# Altium project Placa_Alimentación.PrjPCB
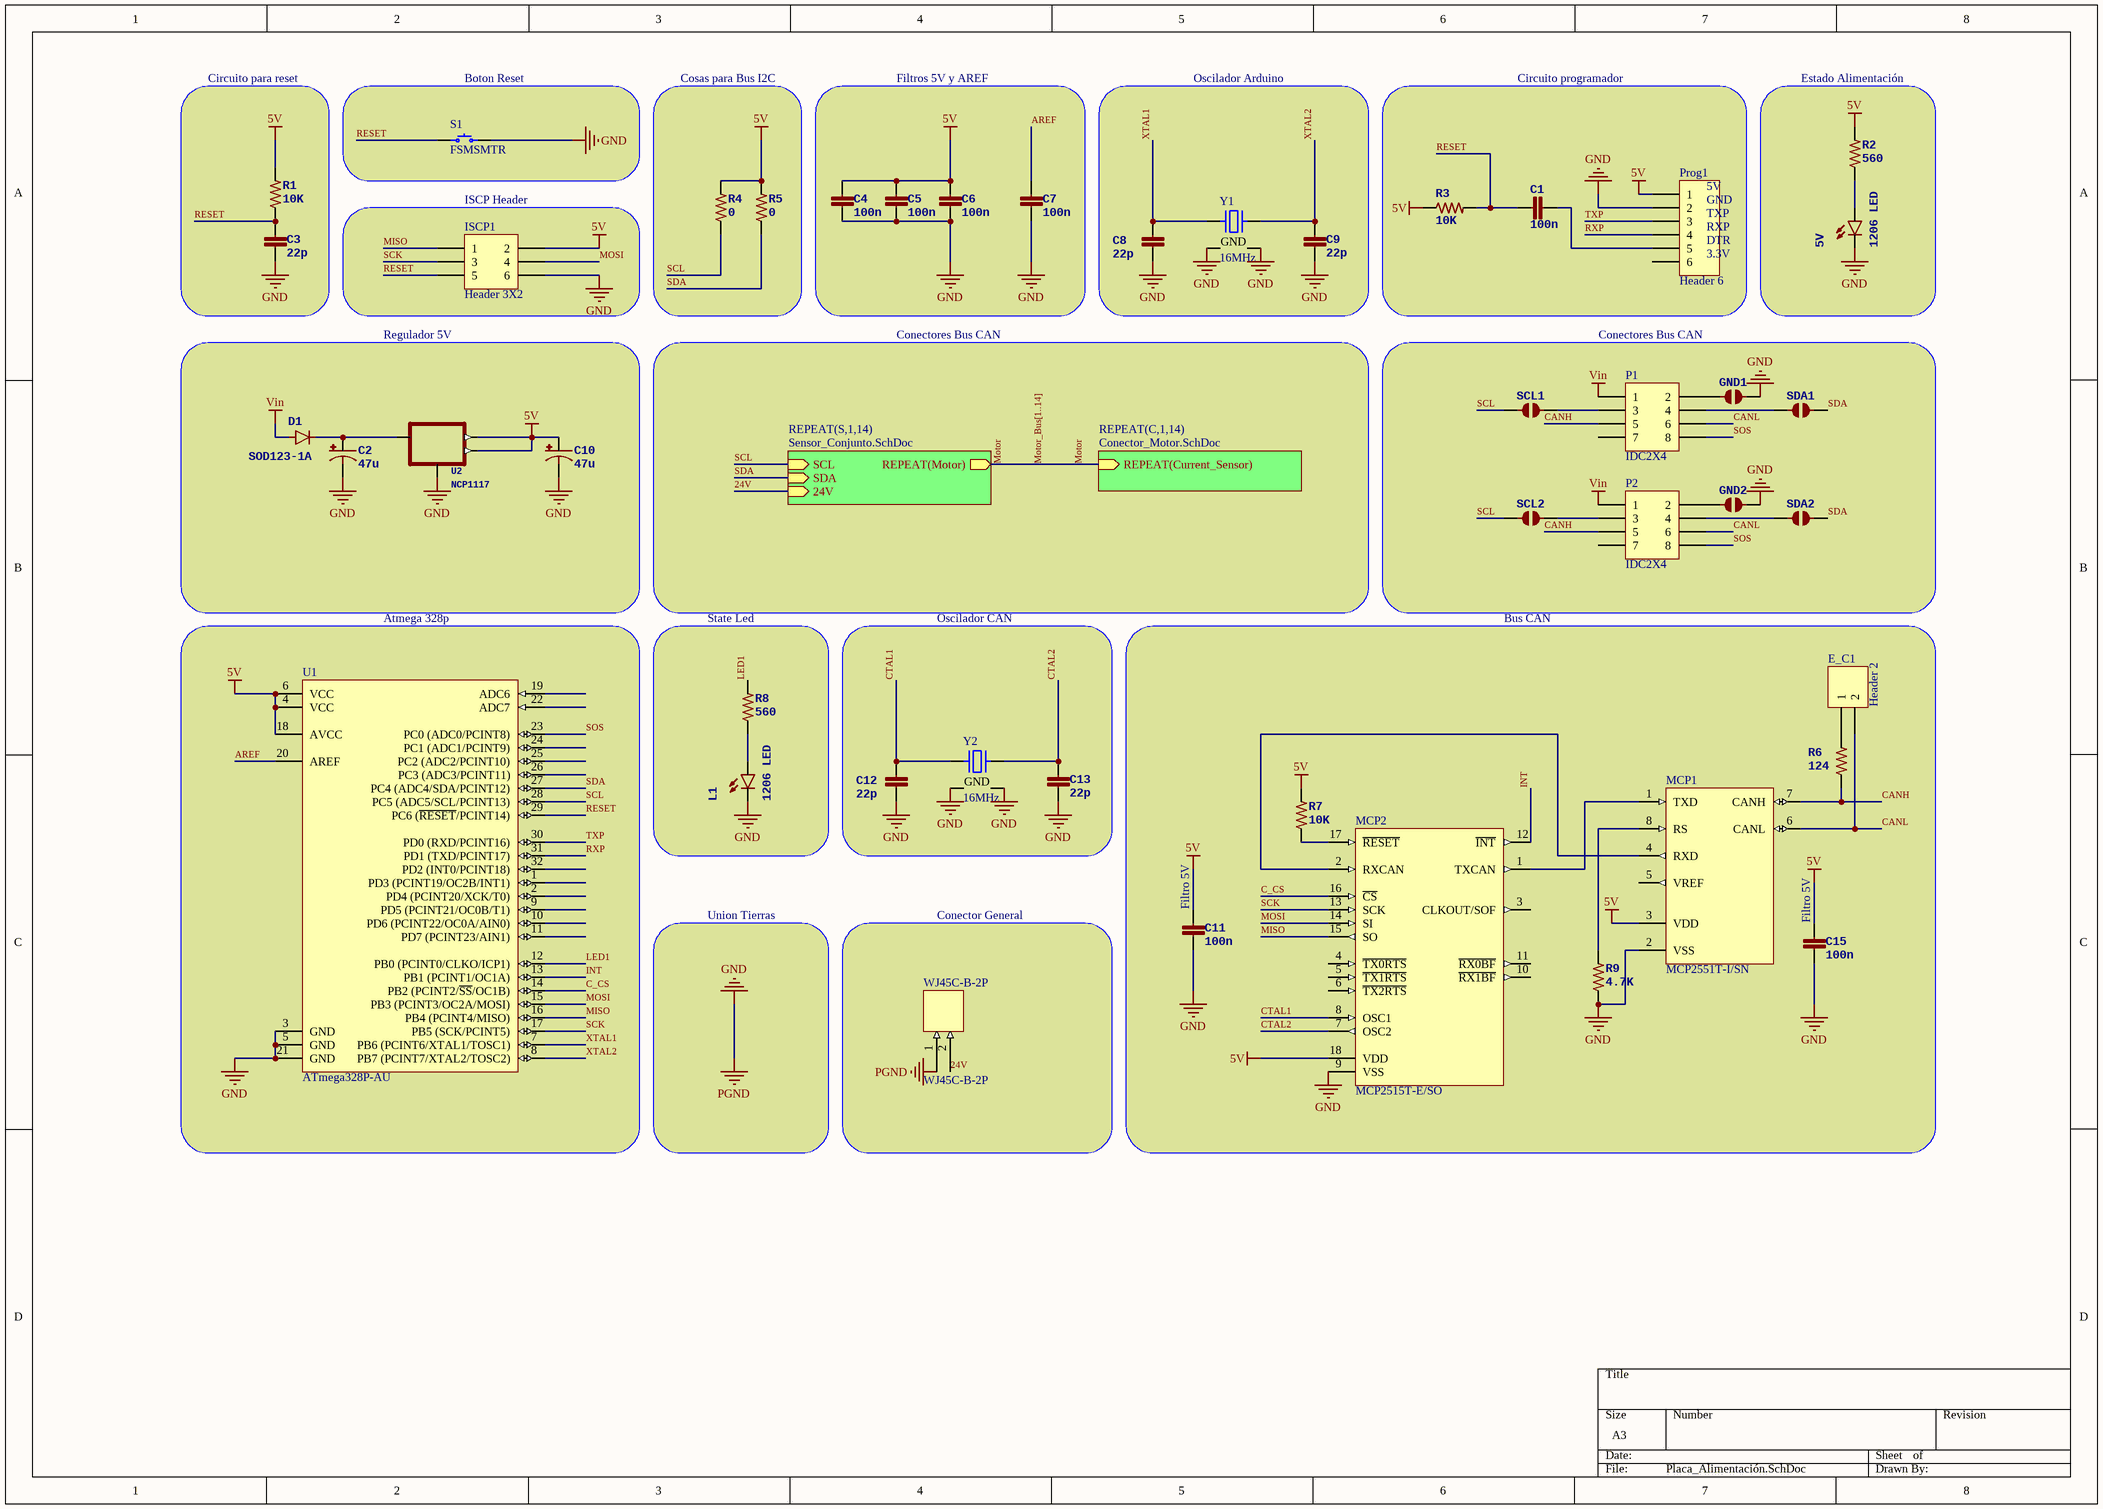
[diagram p0: Placa_Alimentación.SchDoc]
3 sheets, 157 parts. Net scope: hierarchical (ports join the sheet entries above them; power ports are global).
Board file: Placa_Alimentacion_v3.PcbDoc
Sheets:
  Placa_Alimentación.SchDoc
    C1 = Conector_Motor.SchDoc
    C2 = Conector_Motor.SchDoc
    C3 = Conector_Motor.SchDoc
    C4 = Conector_Motor.SchDoc
    C5 = Conector_Motor.SchDoc
    C6 = Conector_Motor.SchDoc
    C7 = Conector_Motor.SchDoc
    C8 = Conector_Motor.SchDoc
    C9 = Conector_Motor.SchDoc
    C10 = Conector_Motor.SchDoc
    C11 = Conector_Motor.SchDoc
    C12 = Conector_Motor.SchDoc
    C13 = Conector_Motor.SchDoc
    C14 = Conector_Motor.SchDoc
    S1 = Sensor_Conjunto.SchDoc
    S2 = Sensor_Conjunto.SchDoc
    S3 = Sensor_Conjunto.SchDoc
    S4 = Sensor_Conjunto.SchDoc
    S5 = Sensor_Conjunto.SchDoc
    S6 = Sensor_Conjunto.SchDoc
    S7 = Sensor_Conjunto.SchDoc
    S8 = Sensor_Conjunto.SchDoc
    S9 = Sensor_Conjunto.SchDoc
    S10 = Sensor_Conjunto.SchDoc
    S11 = Sensor_Conjunto.SchDoc
    S12 = Sensor_Conjunto.SchDoc
    S13 = Sensor_Conjunto.SchDoc
    S14 = Sensor_Conjunto.SchDoc

## Sheet Placa_Alimentación.SchDoc
size A3

### Parts
5V  1206 LED  [LED-1206]
C1  100n  [0805]
C2  47u  [PANASONIC_D]
C3  22p  [0805]
C4  100n  [0805]
C5  100n  [0805]
C6  100n  [0805]
C7  100n  [0805]
C8  22p  [0805]
C9  22p  [0805]
C10  47u  [PANASONIC_D]
C11  100n  [0805]
C12  22p  [0805]
C13  22p  [0805]
C15  100n  [0805]
D1  SOD123-1A  [SOD-123]
E_C1  Header 2  [HDR1X2]
GND1  JUMPER-PAD-2-NOYES_SILK  [PAD-JUMPER-2-NO_YES_SILK]  (value not drawn)
GND2  JUMPER-PAD-2-NOYES_SILK  [PAD-JUMPER-2-NO_YES_SILK]  (value not drawn)
ISCP1  Header 3X2  [HDR2X3]
L1  1206 LED  [LED-1206]
MCP1  MCP2551T-I/SN  [SOIC-SN8_N]
MCP2  MCP2515T-E/SO  [SOIC-SO18_N]
P1  IDC2X4  [IDC2X4]
P2  IDC2X4  [IDC2X4]
Prog1  Header 6  [HDR1X6]
R1  10K  [0805]
R2  560  [0805]
R3  10K  [0805]
R4  0  [0805]
R5  0  [0805]
R6  124  [0805]
R7  10K  [0805]
R8  560  [0805]
R9  4.7K  [0805]
S1  FSMSMTR  [TE FSMSMTR]
SCL1  JUMPER-PAD-2-NOYES_SILK  [PAD-JUMPER-2-NO_YES_SILK]  (value not drawn)
SCL2  JUMPER-PAD-2-NOYES_SILK  [PAD-JUMPER-2-NO_YES_SILK]  (value not drawn)
SDA1  JUMPER-PAD-2-NOYES_SILK  [PAD-JUMPER-2-NO_YES_SILK]  (value not drawn)
SDA2  JUMPER-PAD-2-NOYES_SILK  [PAD-JUMPER-2-NO_YES_SILK]  (value not drawn)
U1  ATmega328P-AU  [32A_N]
U2  NCP1117  [SOT223]
WJ45C-B-2P  WJ45C-B-2P  [WJ45C-B-2P]
Y1  16MHz  [NDK NX3225SA]
Y2  16MHz  [NDK NX3225SA]

### Blocks framed on the sheet
Circuito para reset: C3 R1
Boton Reset: S1
Cosas para Bus I2C: R4 R5
Filtros 5V y AREF: C4-C7
Oscilador Arduino: C8 C9 Y1
Estado Alimentación: 5V R2
ISCP Header: ISCP1
Regulador 5V: C2 C10 D1 U2
Conectores Bus CAN: GND1 GND2 P1 P2 SCL1 SCL2 SDA1 SDA2
Atmega 328p: U1
State Led: L1 R8
Oscilador CAN: C12 C13 Y2
Conector General: WJ45C-B-2P

### Sub-sheets
REPEAT(C,1,14) = Conector_Motor.SchDoc: REPEAT(Current_Sensor) (in)
REPEAT(S,1,14) = Sensor_Conjunto.SchDoc: REPEAT(Motor) (out), SCL (in), SDA (in), 24V (in)

### Nets
5V: C4.1 C5.1 C6.1 C10.+ C11.1 C15.1 ISCP1.2 MCP1.3(VDD) MCP2.18(VDD) Prog1.1 R1.2 R2.2 R3.1 R4.2 R5.2 R7.2 U1.4(VCC) U1.6(VCC) U1.18(AVCC) U2.2(OUT) U2.4(OUT@1)
GND: 5V.C C2.- C3.2 C4.2 C5.2 C6.2 C7.2 C8.2 C9.2 C10.- C11.2 C12.2 C13.2 C15.2 GND1.2 GND2.2 ISCP1.6 L1.C MCP1.2(VSS) MCP2.9(VSS) Prog1.2 R9.1 S1.2 U1.3(GND) U1.5(GND) U1.21(GND) U2.1(ADJ) WJ45C-B-2P.1 Y1.2(GND) Y1.4(GND) Y2.2(GND) Y2.4(GND)  [also labelled PGND]
Vin: D1.A P1.1 P2.1
24V: WJ45C-B-2P.2 ; sheet REPEAT(S,1,14)/24V
AREF: C7.1 U1.20(AREF)
C_CS: MCP2.16(~{CS}) U1.14(PB2_(PCINT2/~{SS}/OC1B))
CANH: MCP1.7(CANH) P1.5 P2.5 R6.1
CANL: E_C1.2 MCP1.6(CANL) P1.6 P2.6
CTAL1: C12.1 MCP2.8(OSC1) Y2.1
CTAL2: C13.1 MCP2.7(OSC2) Y2.3
INT: MCP2.12(~{INT}) U1.13(PB1_(PCINT1/OC1A))
LED1: R8.2 U1.12(PB0_(PCINT0/CLKO/ICP1))
MISO: ISCP1.1 MCP2.15(SO) U1.16(PB4_(PCINT4/MISO))
MOSI: ISCP1.4 MCP2.14(SI) U1.15(PB3_(PCINT3/OC2A/MOSI))
Motor: sheet REPEAT(C,1,14)/REPEAT(Current_Sensor), sheet REPEAT(S,1,14)/REPEAT(Motor)
RESET: C1.1 C3.1 ISCP1.5 R1.1 R3.2 S1.1 U1.29(PC6_(~{RESET}/PCINT14))
RXP: Prog1.4 U1.31(PD1_(TXD/PCINT17))
SCK: ISCP1.3 MCP2.13(SCK) U1.17(PB5_(SCK/PCINT5))
SCL: R4.1 SCL1.1 SCL2.1 U1.28(PC5_(ADC5/SCL/PCINT13)) ; sheet REPEAT(S,1,14)/SCL
SDA: R5.1 SDA1.2 SDA2.2 U1.27(PC4_(ADC4/SDA/PCINT12)) ; sheet REPEAT(S,1,14)/SDA
SOS: P1.8 P2.8 U1.23(PC0_(ADC0/PCINT8))
TXP: Prog1.3 U1.30(PD0_(RXD/PCINT16))
XTAL1: C8.1 U1.7(PB6_(PCINT6/XTAL1/TOSC1)) Y1.1
XTAL2: C9.1 U1.8(PB7_(PCINT7/XTAL2/TOSC2)) Y1.3
Net5V_A: 5V.A R2.1
NetC1_2: C1.2 Prog1.5
NetC2_+: C2.+ D1.C U2.3(IN)
NetE_C1_1: E_C1.1 R6.2
NetGND1_1: GND1.1 P1.2
NetGND2_1: GND2.1 P2.2
NetL1_A: L1.A R8.1
NetMCP1_1: MCP1.1(TXD) MCP2.1(TXCAN)
NetMCP1_4: MCP1.4(RXD) MCP2.2(RXCAN)
NetMCP1_8: MCP1.8(RS) R9.2
NetMCP2_17: MCP2.17(~{RESET}) R7.1
NetP1_3: P1.3 SCL1.2
NetP1_4: P1.4 SDA1.1
NetP2_3: P2.3 SCL2.2
NetP2_4: P2.4 SDA2.1

Not connected (* = marked no-connect by the designer): MCP1 5(VREF); MCP2 3(CLKOUT/SOF) 4(~{TX0RTS}) 5(~{TX1RTS}) 6(~{TX2RTS}) 10(~{RX1BF}) 11(~{RX0BF}); P1 7; P2 7; Prog1 6; U1 1(PD3_(PCINT19/OC2B/INT1)) 2(PD4_(PCINT20/XCK/T0)) 9(PD5_(PCINT21/OC0B/T1)) 10(PD6_(PCINT22/OC0A/AIN0)) 11(PD7_(PCINT23/AIN1)) 19(ADC6) 22(ADC7) 24(PC1_(ADC1/PCINT9)) 25(PC2_(ADC2/PCINT10)) 26(PC3_(ADC3/PCINT11)) 32(PD2_(INT0/PCINT18))

### Buses and harness runs
bus Motor_Bus[1..14]

### Notes on the sheet
- Circuito programador
- (near Prog1) 5V
- (near Prog1) GND
- (near Prog1) TXP
- (near Prog1) RXP
- (near Prog1) DTR
- (near Prog1) 3.3V
- Conectores Bus CAN
- Bus CAN
- Union Tierras
- (near C11) Filtro 5V
- (near C15) Filtro 5V

### Library data of the parts
5V L1 = LED1206
C1 C3-C9 C11-C13 C15 = CAP0805
C2 C10 = 47UF-50V-20%(ELECT): PROD_ID: CAP-10547
D1 = DIODESOD123
E_C1 = Header 2: Header, 2-Pin; LatestRevisionDate: 17-Jul-2002; LatestRevisionNote: Re-released for DXP Platform.; Publisher: Altium Limited
ISCP1 = Header 3X2: Header, 3-Pin, Dual row; LatestRevisionDate: 17-Jul-2002; LatestRevisionNote: Re-released for DXP Platform.; Publisher: Altium Limited
MCP1 = MCP2551T-I/SN: High-Speed CAN Transceiver, 8-Pin SOIC, Industrial Temperature, Tape and Reel; Published: 29-Jan-2009; DatasheetVersion: revE, Jan-2007; PackageVersion: revBB, Aug-2009; PackageReference: SOIC-SN8; Publisher: Altium Limited; PackageDescription: 8-Lead Plastic Small Outline (SN) - Narrow, 3.90mm Body [SOIC]; Supplier 1: Digi-Key; Supplier Part Number 1: MCP2551T-I/SNTR-ND; Supplier 2: Farnell; Supplier Part Number 2: 1788569; Code_JEDEC: MS-012; Code_IPC: SOIC127P600-8; ComponentLink1Description: Datasheet; ComponentLink1URL: http://ww1.microchip.com/downloads/en/DeviceDoc/21667E.pdf; ComponentLink2Description: Packaging Specification; ComponentLink2URL: http://www.microchip.com/stellent/groups/techpub_sg/documents/packagingspec/en012702.pdf; ComponentLink3Description: Microchip.com Home; ComponentLink3URL: http://www.microchip.com/
MCP2 = MCP2515T-E/SO: Stand-Alone CAN Controller With SPI Interface, 18-Pin SOIC, Extended Temperature, Tape and Reel; Published: 29-Jan-2009; DatasheetVersion: revE, Nov-2007; PackageVersion: revBB, Aug-2009; PackageReference: SOIC-SO18; Publisher: Altium Limited; PackageDescription: 18-Lead Plastic Small Outline (SO) - Wide 7.50mm Body [SOIC]; Supplier 1: Digi-Key; Supplier Part Number 1: MCP2515T-E/SO-ND; Code_JEDEC: MS-013; ComponentLink1Description: Datasheet; ComponentLink1URL: http://ww1.microchip.com/downloads/en/DeviceDoc/21801e.pdf; ComponentLink2Description: Packaging Specification; ComponentLink2URL: http://www.microchip.com/stellent/groups/techpub_sg/documents/packagingspec/en012702.pdf; ComponentLink3Description: Microchip.com Home; ComponentLink3URL: http://www.microchip.com/
P1 P2 = IDC2X4: Header, 4-Pin, Dual row; LatestRevisionDate: 17-Jul-2002; LatestRevisionNote: Re-released for DXP Platform.; Publisher: Altium Limited
Prog1 = Header 6: Header, 6-Pin; LatestRevisionDate: 17-Jul-2002; LatestRevisionNote: Re-released for DXP Platform.; Publisher: Altium Limited
R1-R9 = RESISTOR0805-RES
S1 = FSMSMTR: SWITCH TACTILE SPST-NO 0.05A 24V; Manufacturer: TE Connectivity Alcoswitch Switches; Switch Function: Off-Mom; Contact Rating @ Voltage: 0.05A @ 24VDC; Actuator Type: Standard; Actuator Orientation: Top Actuated; Illumination: Non-Illuminated; Operating Force: 180gf; Switch Travel: 0.25mm; Mechanical Life: 20,000 Cycles; Part Number: FSMSMTR; PartId: 8251; Supplier 1: Digi-Key; Supplier Part Number 1: 450-1758-2-ND; ComponentLink1Description: Datasheet; ComponentLink1URL: http://www.te.com/commerce/DocumentDelivery/DDEController?Action=srchrtrv&DocNm=1437566-3&DocType=Customer+Drawing&DocLang=English; ComponentLink2Description: Digi-Key Listing; ComponentLink2URL: http://www.digikey.com/product-detail/en/FSMSMTR/450-1758-2-ND/529671; Price: 0,175; Circuit: SPST-NO; Illumination Voltage: -; Illumination Type, Colour: -; Operating Temperature: -35C ~ 85C
U1 = ATmega328P-AU: 8-bit AVR Microcontroller, 32KB Flash, 1KB EEPROM, 2KB SRAM, 32-pin TQFP, Industrial Grade (-40°C to 85°C); Published: 1-Apr-2010; DatasheetVersion: revA, Jan-2010; PackageVersion: revB, Oct-2001; PackageReference: 32A; Publisher: Altium Limited; PackageDescription: 32-Lead, 7x7x1.0 mm Body, 0.8mm Lead Pitch, Thin Profile Plastic Quad Flat Package (TQFP); Supplier 1: Digi-Key; Supplier Part Number 1: ATMEGA328P-AU-ND; Supplier 2: Farnell; Supplier Part Number 2: 1715486; Supplier 3: Mouser; Supplier Part Number 3: 556-ATMEGA328P-AU; Code_JEDEC: MS-026-ABA; ComponentLink1Description: Manufacturer Link; ComponentLink1URL: http://www.atmel.com/products/avr/default.asp?; ComponentLink2Description: ATmega48A/48PA/88A/88PA/168A/168PA/328/328P Datasheet; ComponentLink2URL: http://www.atmel.com/dyn/resources/prod_documents/8271.pdf; ComponentLink3Description: ATmega48A/48PA/88A/88PA/168A/168PA/328/328P Summary; ComponentLink3URL: http://www.atmel.com/dyn/resources/prod_documents/8271S.pdf; ComponentLink4Description: Atmel.com Home; ComponentLink4URL: http://www.atmel.com
U2 = V_REG_LM1117SOT223: PROD_ID: VREG-08170
Y1 Y2 = NX3225SA-16.000MHZ-STD-CSR-1: CRYSTAL 16.0000MHZ 8PF SMD; Manufacturer: NDK; Frequency Stability: 15ppm; ESR: 80 Ohm; Operating Mode: Fundamental; Part Number: NX3225SA-16.000MHZ-STD-CSR-1; PartId: 8509; Supplier 1: Digi-Key; Supplier Part Number 1: 644-1049-2-ND; ComponentLink1Description: Datasheet; ComponentLink1URL: http://media.digikey.com/pdf/Data%20Sheets/NDK%20PDFs/NX3225SA.pdf; ComponentLink2Description: Digi-Key Listing; ComponentLink2URL: http://www.digikey.com/product-detail/en/NX3225SA-16.000MHZ-STD-CSR-1/644-1049-2-ND/1128831; Price: 0,3799; Type: MHz Crystal; Device Package: 4-SMD, No Lead (DFN, LCC); Frequency: 16MHz; Frequency Tolerance: 15ppm; Load Capacitance: 8pF

## Sheet Conector_Motor.SchDoc
size A4
Used 14 times, as channels C1, C2, C3, C4, C5, C6, C7, C8, C9, C10, C11, C12, C13, C14. Parts and nets are listed once, with the designators drawn on the sheet.
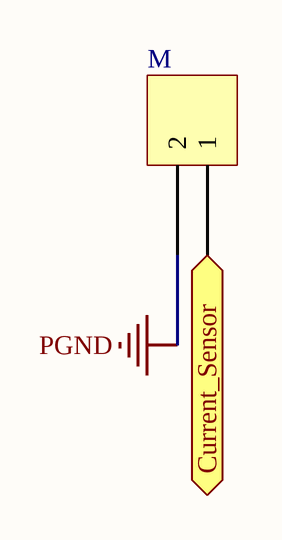
[diagram p1: Conector_Motor.SchDoc]

### Parts
M  20020110-D021A01LF  [FCI 06-381-2PIN]  (value not drawn)

### Ports
Current_Sensor (in)

### Nets
PGND: M.2
Current_Sensor: M.1 ; port Current_Sensor

### Channels
C1: designators end in _C1; ports Current_Sensor=M
C2: designators end in _C2; ports Current_Sensor=M
C3: designators end in _C3; ports Current_Sensor=M
C4: designators end in _C4; ports Current_Sensor=M
C5: designators end in _C5; ports Current_Sensor=M
C6: designators end in _C6; ports Current_Sensor=M
C7: designators end in _C7; ports Current_Sensor=M
C8: designators end in _C8; ports Current_Sensor=M
C9: designators end in _C9; ports Current_Sensor=M
C10: designators end in _C10; ports Current_Sensor=M
C11: designators end in _C11; ports Current_Sensor=M
C12: designators end in _C12; ports Current_Sensor=M
C13: designators end in _C13; ports Current_Sensor=M
C14: designators end in _C14; ports Current_Sensor=M

### Library data of the parts
M = 20020110-D021A01LF: TERM BLOCK HDR 2POS R/A 3.81MM; Manufacturer: FCI; TemperatureRange: -40C ~ 115C; Voltage: 300V; Pitch: 0.150" (3.81mm); Number Of Positions: 2; Number Of Levels: 1; Part Number: 20020110-D021A01LF; PartId: 7785; Supplier 1: Digi-Key; Supplier Part Number 1: 609-3819-ND; ComponentLink1Description: Datasheet; ComponentLink1URL: http://portal.fciconnect.com/Comergent//fci/drawing/20020110.pdf; ComponentLink2Description: Digi-Key Listing; ComponentLink2URL: http://www.digikey.ca/product-detail/en/20020110-D021A01LF/609-3819-ND/2261255; Price: 0,75; Type: Through Hole; Colour: Green; Orientation: 90, Right Angle; Positions Per Level: 2

## Sheet Sensor_Conjunto.SchDoc
size A4
Used 14 times, as channels S1, S2, S3, S4, S5, S6, S7, S8, S9, S10, S11, S12, S13, S14. Parts and nets are listed once, with the designators drawn on the sheet.
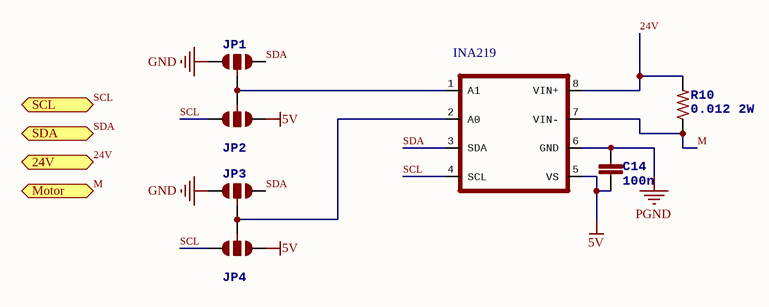
[diagram p2: Sensor_Conjunto.SchDoc]

### Parts
C14  100n  [0805]
IC1  INA219  [SO08]
JP1  JUMPER-PAD-3-NOYES_SILK  [PAD-JUMPER-3-NO_YES_SILK]  (value not drawn)
JP2  JUMPER-PAD-3-NOYES_SILK  [PAD-JUMPER-3-NO_YES_SILK]  (value not drawn)
JP3  JUMPER-PAD-3-NOYES_SILK  [PAD-JUMPER-3-NO_YES_SILK]  (value not drawn)
JP4  JUMPER-PAD-3-NOYES_SILK  [PAD-JUMPER-3-NO_YES_SILK]  (value not drawn)
R10  0.012 2W  [R2512]

### Ports
24V (in), Motor (out), SCL (in), SDA (in)

### Nets
5V: C14.1 IC1.5(VS) JP2.1 JP4.1
GND: JP1.1 JP3.1
PGND: C14.2 IC1.6(GND)
24V: IC1.8(VIN+) R10.2 ; port 24V
M: IC1.7(VIN-) R10.1 ; port Motor
SCL: IC1.4(SCL) JP2.3 JP4.3 ; port SCL
SDA: IC1.3(SDA) JP1.3 JP3.3 ; port SDA
NetIC1_1: IC1.1(A1) JP1.2 JP2.2
NetIC1_2: IC1.2(A0) JP3.2 JP4.2

### Channels
S1: designators end in _S1; ports 24V=24V Motor=M SCL=SCL SDA=SDA
S2: designators end in _S2; ports 24V=24V Motor=M SCL=SCL SDA=SDA
S3: designators end in _S3; ports 24V=24V Motor=M SCL=SCL SDA=SDA
S4: designators end in _S4; ports 24V=24V Motor=M SCL=SCL SDA=SDA
S5: designators end in _S5; ports 24V=24V Motor=M SCL=SCL SDA=SDA
S6: designators end in _S6; ports 24V=24V Motor=M SCL=SCL SDA=SDA
S7: designators end in _S7; ports 24V=24V Motor=M SCL=SCL SDA=SDA
S8: designators end in _S8; ports 24V=24V Motor=M SCL=SCL SDA=SDA
S9: designators end in _S9; ports 24V=24V Motor=M SCL=SCL SDA=SDA
S10: designators end in _S10; ports 24V=24V Motor=M SCL=SCL SDA=SDA
S11: designators end in _S11; ports 24V=24V Motor=M SCL=SCL SDA=SDA
S12: designators end in _S12; ports 24V=24V Motor=M SCL=SCL SDA=SDA
S13: designators end in _S13; ports 24V=24V Motor=M SCL=SCL SDA=SDA
S14: designators end in _S14; ports 24V=24V Motor=M SCL=SCL SDA=SDA

### Library data of the parts
C14 = CAP0805
IC1 = INA219-SO8D
R10 = RESISTOR2512

## Nets that join several sheets
5V: Placa_Alimentación (21 pins), S1 (C14_S1.1 IC1_S1.5 JP2_S1.1 JP4_S1.1), S2 (C14_S2.1 IC1_S2.5 JP2_S2.1 JP4_S2.1), S3 (C14_S3.1 IC1_S3.5 JP2_S3.1 JP4_S3.1), S4 (C14_S4.1 IC1_S4.5 JP2_S4.1 JP4_S4.1), S5 (C14_S5.1 IC1_S5.5 JP2_S5.1 JP4_S5.1), S6 (C14_S6.1 IC1_S6.5 JP2_S6.1 JP4_S6.1), S7 (C14_S7.1 IC1_S7.5 JP2_S7.1 JP4_S7.1), S8 (C14_S8.1 IC1_S8.5 JP2_S8.1 JP4_S8.1), S9 (C14_S9.1 IC1_S9.5 JP2_S9.1 JP4_S9.1), S10 (C14_S10.1 IC1_S10.5 JP2_S10.1 JP4_S10.1), S11 (C14_S11.1 IC1_S11.5 JP2_S11.1 JP4_S11.1), S12 (C14_S12.1 IC1_S12.5 JP2_S12.1 JP4_S12.1), S13 (C14_S13.1 IC1_S13.5 JP2_S13.1 JP4_S13.1), S14 (C14_S14.1 IC1_S14.5 JP2_S14.1 JP4_S14.1)
GND: Placa_Alimentación (32 pins), C1 (M_C1.2), C2 (M_C2.2), C3 (M_C3.2), C4 (M_C4.2), C5 (M_C5.2), C6 (M_C6.2), C7 (M_C7.2), C8 (M_C8.2), C9 (M_C9.2), C10 (M_C10.2), C11 (M_C11.2), C12 (M_C12.2), C13 (M_C13.2), C14 (M_C14.2), S1 (C14_S1.2 IC1_S1.6 JP1_S1.1 JP3_S1.1), S2 (C14_S2.2 IC1_S2.6 JP1_S2.1 JP3_S2.1), S3 (C14_S3.2 IC1_S3.6 JP1_S3.1 JP3_S3.1), S4 (C14_S4.2 IC1_S4.6 JP1_S4.1 JP3_S4.1), S5 (C14_S5.2 IC1_S5.6 JP1_S5.1 JP3_S5.1), S6 (C14_S6.2 IC1_S6.6 JP1_S6.1 JP3_S6.1), S7 (C14_S7.2 IC1_S7.6 JP1_S7.1 JP3_S7.1), S8 (C14_S8.2 IC1_S8.6 JP1_S8.1 JP3_S8.1), S9 (C14_S9.2 IC1_S9.6 JP1_S9.1 JP3_S9.1), S10 (C14_S10.2 IC1_S10.6 JP1_S10.1 JP3_S10.1), S11 (C14_S11.2 IC1_S11.6 JP1_S11.1 JP3_S11.1), S12 (C14_S12.2 IC1_S12.6 JP1_S12.1 JP3_S12.1), S13 (C14_S13.2 IC1_S13.6 JP1_S13.1 JP3_S13.1), S14 (C14_S14.2 IC1_S14.6 JP1_S14.1 JP3_S14.1)
24V: Placa_Alimentación (WJ45C-B-2P.2), S1 (IC1_S1.8 R10_S1.2), S2 (IC1_S2.8 R10_S2.2), S3 (IC1_S3.8 R10_S3.2), S4 (IC1_S4.8 R10_S4.2), S5 (IC1_S5.8 R10_S5.2), S6 (IC1_S6.8 R10_S6.2), S7 (IC1_S7.8 R10_S7.2), S8 (IC1_S8.8 R10_S8.2), S9 (IC1_S9.8 R10_S9.2), S10 (IC1_S10.8 R10_S10.2), S11 (IC1_S11.8 R10_S11.2), S12 (IC1_S12.8 R10_S12.2), S13 (IC1_S13.8 R10_S13.2), S14 (IC1_S14.8 R10_S14.2)
M: C1 (M_C1.1), S1 (IC1_S1.7 R10_S1.1)
M: C2 (M_C2.1), S2 (IC1_S2.7 R10_S2.1)
M: C3 (M_C3.1), S3 (IC1_S3.7 R10_S3.1)
M: C4 (M_C4.1), S4 (IC1_S4.7 R10_S4.1)
M: C5 (M_C5.1), S5 (IC1_S5.7 R10_S5.1)
M: C6 (M_C6.1), S6 (IC1_S6.7 R10_S6.1)
M: C7 (M_C7.1), S7 (IC1_S7.7 R10_S7.1)
M: C8 (M_C8.1), S8 (IC1_S8.7 R10_S8.1)
M: C9 (M_C9.1), S9 (IC1_S9.7 R10_S9.1)
M: C10 (M_C10.1), S10 (IC1_S10.7 R10_S10.1)
M: C11 (M_C11.1), S11 (IC1_S11.7 R10_S11.1)
M: C12 (M_C12.1), S12 (IC1_S12.7 R10_S12.1)
M: C13 (M_C13.1), S13 (IC1_S13.7 R10_S13.1)
M: C14 (M_C14.1), S14 (IC1_S14.7 R10_S14.1)
SCL: Placa_Alimentación (R4.1 SCL1.1 SCL2.1 U1.28), S1 (IC1_S1.4 JP2_S1.3 JP4_S1.3), S2 (IC1_S2.4 JP2_S2.3 JP4_S2.3), S3 (IC1_S3.4 JP2_S3.3 JP4_S3.3), S4 (IC1_S4.4 JP2_S4.3 JP4_S4.3), S5 (IC1_S5.4 JP2_S5.3 JP4_S5.3), S6 (IC1_S6.4 JP2_S6.3 JP4_S6.3), S7 (IC1_S7.4 JP2_S7.3 JP4_S7.3), S8 (IC1_S8.4 JP2_S8.3 JP4_S8.3), S9 (IC1_S9.4 JP2_S9.3 JP4_S9.3), S10 (IC1_S10.4 JP2_S10.3 JP4_S10.3), S11 (IC1_S11.4 JP2_S11.3 JP4_S11.3), S12 (IC1_S12.4 JP2_S12.3 JP4_S12.3), S13 (IC1_S13.4 JP2_S13.3 JP4_S13.3), S14 (IC1_S14.4 JP2_S14.3 JP4_S14.3)
SDA: Placa_Alimentación (R5.1 SDA1.2 SDA2.2 U1.27), S1 (IC1_S1.3 JP1_S1.3 JP3_S1.3), S2 (IC1_S2.3 JP1_S2.3 JP3_S2.3), S3 (IC1_S3.3 JP1_S3.3 JP3_S3.3), S4 (IC1_S4.3 JP1_S4.3 JP3_S4.3), S5 (IC1_S5.3 JP1_S5.3 JP3_S5.3), S6 (IC1_S6.3 JP1_S6.3 JP3_S6.3), S7 (IC1_S7.3 JP1_S7.3 JP3_S7.3), S8 (IC1_S8.3 JP1_S8.3 JP3_S8.3), S9 (IC1_S9.3 JP1_S9.3 JP3_S9.3), S10 (IC1_S10.3 JP1_S10.3 JP3_S10.3), S11 (IC1_S11.3 JP1_S11.3 JP3_S11.3), S12 (IC1_S12.3 JP1_S12.3 JP3_S12.3), S13 (IC1_S13.3 JP1_S13.3 JP3_S13.3), S14 (IC1_S14.3 JP1_S14.3 JP3_S14.3)